# EAGLE design armalampMINI (EAGLE 7.6.0)
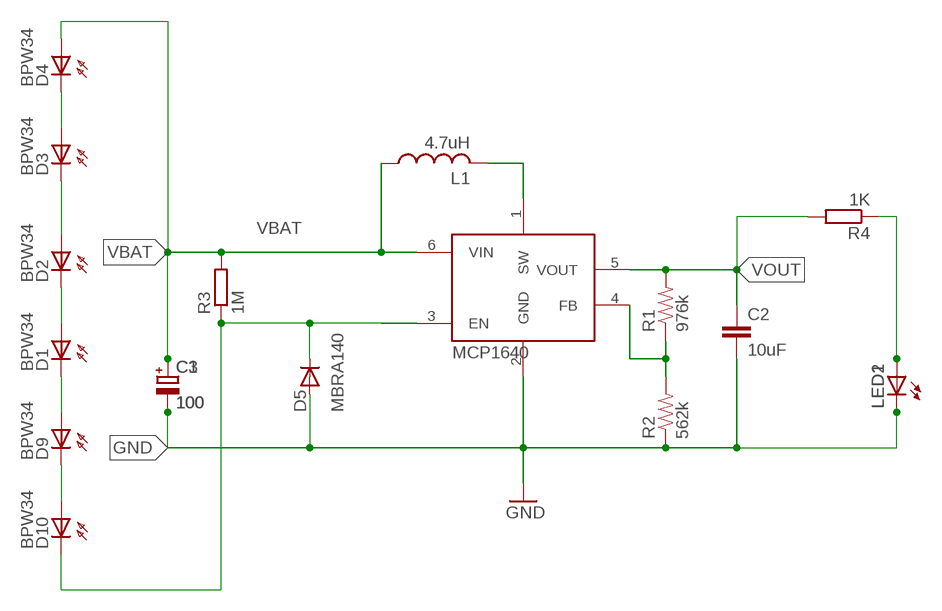
[diagram p0: schematic, sheet 1]

## Parts
C1  100  CPOL-EUTT2D7L  [TT2D7L]
C2  10uF  CAP0805  [0805]
C3  100  CPOL-EUTT2D7L  [TT2D7L]
D1  BPW34  BP104  [BP104]
D2  BPW34  BP104  [BP104]
D3  BPW34  BP104  [BP104]
D4  BPW34  BP104  [BP104]
D5  MBRA140  DIODESOD  [SOD-323]
D9  BPW34  BP104  [BP104]
D10  BPW34  BP104  [BP104]
L1  4.7uH  LLQH44P_P0  [LQH44]
LED1  LED5MM  [LED5MM]
LED2  LEDKA-3528ASYC  [KA-3528ASYC]
R1  976k  RESISTOR0805-RES  [0805]
R2  562k  RESISTOR0805-RES  [0805]
R3  1M  R-EU_R0603  [R0603]
R4  1K  R-EU_R0603  [R0603]
U1  MCP1640  [SOT23-6]

## Nets
GND [GND]: C1.- C2.2 C3.- D5.2(A) LED1.K(C) LED2.C R2.1 U1.2(GND)
N$1: L1.P$2 U1.1(SW)
N$2: R1.1 R2.2 U1.4(FB)
N$3: D3.A D4.K(C)
N$4: D5.1(C) D10.K(C) R3.1 U1.3(EN)
N$5: LED1.A LED2.A R4.1
N$8: D9.K(C) D10.A
N$9: D1.K(C) D9.A
N$10: D1.A D2.K(C)
N$11: D2.A D3.K(C)
VBAT: C1.+ C3.+ D4.A L1.P$1 R3.2 U1.6(VIN)
VOUT: C2.1 R1.2 R4.2 U1.5(VOUT)

## Library data of the parts
C1 C3 = resistor:CPOL-EU: POLARIZED CAPACITOR, European symbol
C2 = SparkFun:CAP: Capacitor Standard 0603 ceramic capacitor, and 0.1" leaded capacitor.
D1-D4 D9 D10 = opto-trans-siemens:BP104: PHOTO DIODE
D5 = SparkFun:DIODE: Diode These are standard reverse protection diodes and small signal diodes. SMA package can handle up to about 1A. SOD-323 can handle about 200mA. What the SOD-323 package when ordering, there are some mfgs out there that are 5-pin packages.
L1 = karlnet-parts:L
LED1 LED2 = led:LED: LED OSRAM: - CHIPLED LG R971, LG N971, LY N971, LG Q971, LY Q971, LO R971, LY R971 LH N974, LH R974 LS Q976, LO Q976, LY Q976 LO Q996 - Hyper CHIPLED LW Q18S LB Q993, LB Q99A, LB R99A - SideLED LS A670, LO A670, LY A670, LG A670, LP A670 LB A673, LV A673, LT A673, LW A673 LH A674 LY A675 LS A676, LA A676, LO A676, LY A676, LW A676 LS A679, LY A679, LG A679 - Hyper Micro SIDELED® LS Y876, LA Y876, LO Y876, LY Y876 LT Y87S - SmartLED LW L88C, LW L88S LB L89C, LB L89S, LG L890 LS L89K, LO L89K, LY L89K LS L896, LA L896, LO L896, LY L896 - TOPLED LS T670, LO T670, LY T670, LG T670, LP T670 LSG T670, LSP T670, LSY T670, LOP T670, LYG T670 LG T671, LOG T671, LSG T671 LB T673, LV T673, LT T673, LW T673 LH T674 LS T676, LA T676, LO T676, LY T676, LB T676, LH T676, LSB T676, LW T676 LB T67C, LV T67C, LT T67C, LS T67K, LO T67K, LY T67K, LW E67C LS E67B, LA E67B, LO E67B, LY E67B, LB E67C, LV E67C, LT E67C LW T67C LS T679, LY T679, LG T679 LS T770, LO T770, LY T770, LG T770, LP T770 LB T773, LV T773, LT T773, LW T773 LH T774 LS E675, LA E675, LY E675, LS T675 LS T776, LA T776, LO T776, LY T776, LB T776 LHGB T686 LT T68C, LB T68C - Hyper Mini TOPLED® LB M676 - Mini TOPLED Santana® LG M470 LS M47K, LO M47K, LY M47K Source: http://www.osram.convergy.de LUXEON: - LUMILED® LXK2-PW12-R00, LXK2-PW12-S00, LXK2-PW14-U00, LXK2-PW14-V00 LXK2-PM12-R00, LXK2-PM12-S00, LXK2-PM14-U00 LXK2-PE12-Q00, LXK2-PE12-R00, LXK2-PE12-S00, LXK2-PE14-T00, LXK2-PE14-U00 LXK2-PB12-K00, LXK2-PB12-L00, LXK2-PB12-M00, LXK2-PB14-N00, LXK2-PB14-P00, LXK2-PB14-Q00 LXK2-PR12-L00, LXK2-PR12-M00, LXK2-PR14-Q00, LXK2-PR14-R00 LXK2-PD12-Q00, LXK2-PD12-R00, LXK2-PD12-S00 LXK2-PH12-R00, LXK2-PH12-S00 LXK2-PL12-P00, LXK2-PL12-Q00, LXK2-PL12-R00 Source: www.luxeon.com KINGBRIGHT: KA-3528ASYC Source: www.kingbright.com
R1 R2 = SparkFun:RESISTOR: Resistor Basic schematic elements and footprints for 0603, 1206, and PTH resistors.
R3 R4 = rcl:R-EU_: RESISTOR, European symbol
U1 = karlnet-parts:MCP1640: MCP1623, 1624, 1640/B/C/D pwm/pfm or pwm only DC/DC converters, in SOT-23

## Net classes
0 default: width 0.203 mm, drill 0.356 mm, clearance 0.203 mm
1 GND: width 0.203 mm, drill 0.356 mm, clearance 0.203 mm
2 pwr: width 0.203 mm, drill 0.102 mm, clearance 0.203 mm

## Board
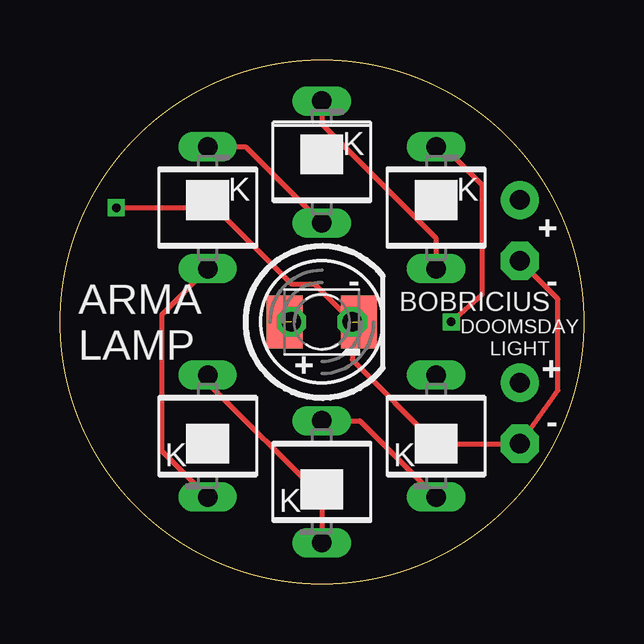
[diagram p1: board, top side]
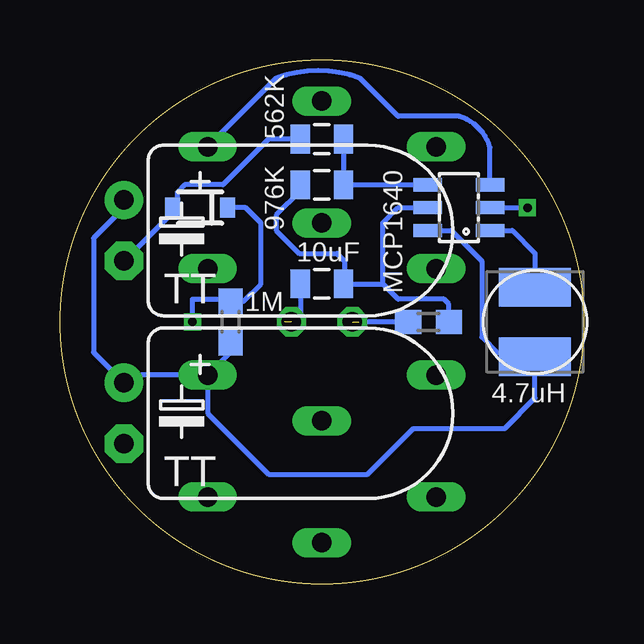
[diagram p2: board, bottom side, seen from below]

Size 21.84 x 21.84 mm. Coordinates in mm from the lower left corner, seen from the top.
Outline: circle at 10.92,10.92 radius 10.92
Copper layers (1*16): Top 0.0356mm / dielectric 1.5011mm / Bottom 0.0356mm
Design rules "default *": minimum track width 8mil, minimum drill 13mil, track to track 8mil, track to pad 8mil, pad to pad 8mil, via to via 8mil, smd to smd 8mil, copper to edge 15mil, drill to drill 12mil, minimum pad ring 7mil, minimum via ring 7mil, stop-mask expansion 4mil, vias tented up to drill 30mil, thermal gap 10mil

### Footprints (pad centres in the part's own frame; a part is rotated, then mirrored left to right if it is on the bottom)
TT2D7L = drill 0.813 pad 1.6: + -1.27,0 | drill 0.813 pad 1.6 octagon: - 1.27,0
0805 = smd 0.8 x 1.2: 1 -0.9,0; 2 0.9,0
BP104 = drill 0.813 long: A 0,2.54; K 0,-2.54
SOD-323 = smd 0.63 x 0.83: 1 -1.15,0; 2 1.15,0
LQH44 = smd 1.6 x 3: P$1 -1.45,0; P$2 1.45,0
LED5MM = drill 0.813 octagon: A -1.27,0; K 1.27,0
KA-3528ASYC = smd 1.5 x 2.2: A -1.55,0; C 1.55,0
R0603 = smd 1.1 x 1: 1 -0.85,0; 2 0.85,0
SOT23-6 = smd 0.55 x 1.2: 1 -0.95,-1.3; 2 0,-1.3; 3 0.95,-1.3; 4 0.95,1.3; 5 0,1.3; 6 -0.95,1.3

### Placement (x,y rotation side)
C1  19.18,7.11 270 bottom
C2  10.92,12.51 180 bottom
C3  19.18,14.73 270 bottom
D1  6.16,15.68 180 top
D2  6.16,6.16 0 top
D3  10.92,4.25 0 top
D4  15.68,6.16 0 top
D5  16,15.68 180 bottom
D9  10.92,17.59 180 top
D10  15.68,15.68 180 top
L1  2.03,10.92 90 bottom
LED1  10.92,10.92 0 top
LED2  10.92,10.92 0 top
R1  10.92,16.64 180 bottom
R2  10.92,18.54 0 bottom
R3  14.73,10.92 270 bottom
R4  6.48,10.92 0 bottom
U1  5.21,15.68 90 bottom

### Tracks (layer width: path | path; a pad name or v marks a point on that pad's centre or on a via)
GND  (via drill 0.36)  (1 unrouted)
  Top 0.203: C3.- 20.77,11.88 20.77,8.07 C1.- 15.68,5.84 12.19,9.33 LED1.K 10.61,12.51 9.65,12.51 6.48,15.68 v2.35,15.68
  Bottom 0.203: R2.1 13.14,18.54 15.05,16.64 16.64,16.64 16.96,16.32 16.96,15.88 D5.2 17.15,15.49 C3.- | C2.2 11.82,11.29 LED1.K | U1.2 v2.35,15.68
N$1
  Bottom 0.203: U1.1 2.99,14.73 2.03,13.78 L1.P$2
N$2
  Bottom 0.203: R2.2 R1.1 U1.4
N$3
  Top 0.203: D3.A 12.51,6.79 D4.K
N$4  (via drill 0.36)
  Top 0.203: D10.K 16,18.22 17.59,16.64 17.59,12.03 v16.32,10.92
  Bottom 0.203: U1.3 3.91,18.2 arc-57 5.21,19.5 7.75,19.5 9.34,21.08 arc-42 12.83,21.08 D10.K | D5.1 14.1,15.68 13.46,15.05 13.46,12.51 14.2,11.77 R3.1 14.84,11.88 16.32,11.88 v16.32,10.92
N$5  (1 unrouted)
  Bottom 0.203: R4.1 LED1.A
N$8
  Top 0.203: D9.K 10.92,19.18 15.68,14.41 D10.A
N$9
  Top 0.203: D1.K 7.75,18.22 D9.A
N$10
  Top 0.203: D2.K 4.26,5.52 4.26,11.24 D1.A
N$11
  Top 0.203: D2.A 6.16,8.38 10.92,3.62 D3.K
VBAT
  Bottom 0.203: U1.6 5.53,14.73 4.26,13.46 4.26,10.29 3.62,9.65 2.21,9.65 L1.P$1 2.03,7.75 3.3,6.48 7.11,6.48 9.02,4.57 13.14,4.57 15.68,7.11 D4.A | C3.+ 19.18,15.68 20.45,14.41 20.45,9.65 C1.+ 18.86,8.7 D4.A | R3.2 14.73,9.65 D4.A
VOUT
  Bottom 0.203: R4.2 5.63,11.66 5.84,11.88 7.75,11.88 8.38,12.51 | 8.38,12.51 8.38,15.05 7.75,15.68 U1.5 | 8.38,12.51 C2.1 9.97,12.88 9.97,13.46 10.29,13.78 11.87,13.78 12.83,14.73 12.83,15.37 11.82,16.37 R1.2

### Text on the board
tNames: + | - | - | BOBRICIUS | + | DOOMSDAY / LIGHT | ARMA / LAMP | + | -
bNames: 562K | MCP1640 | 976K | 10uF | 1M | 4.7uH